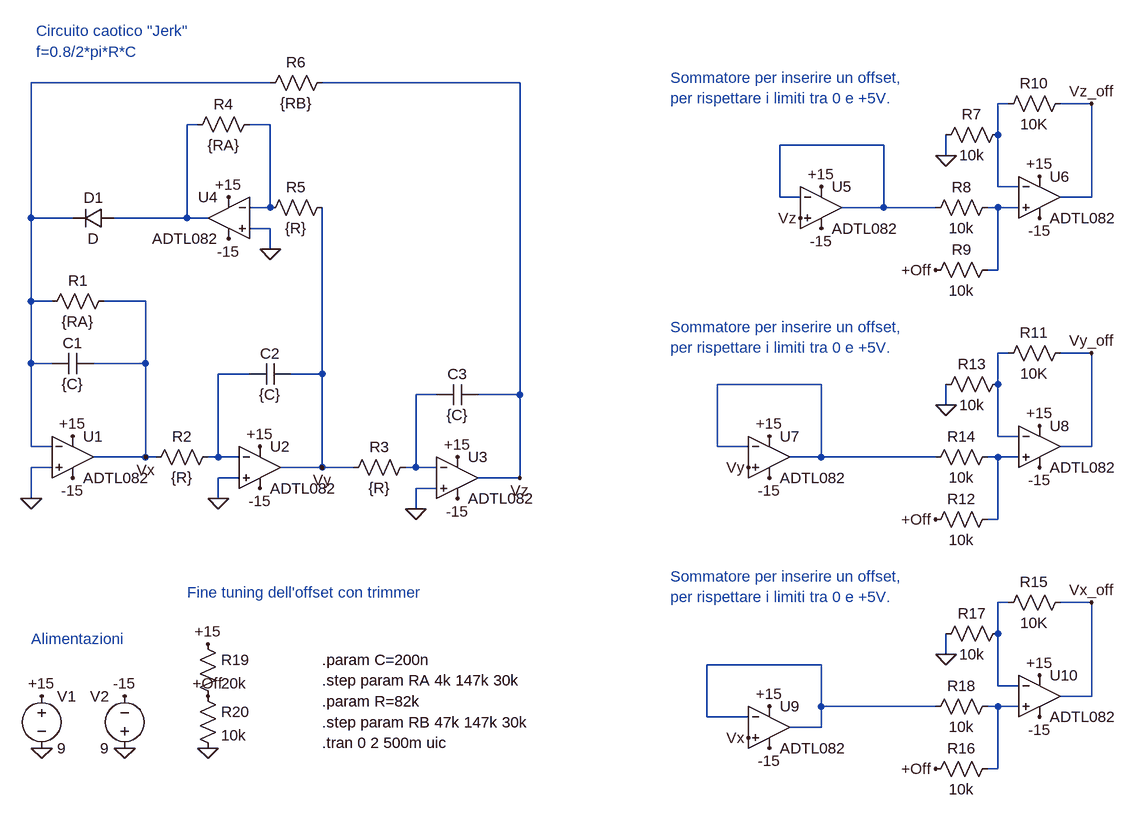
[diagram p0: schematic Spinta.asc]
Spinta.asc, the LTspice schematic file:
Version 4.1
SHEET 1 2248 976
WIRE 368 -336 0 -336
WIRE 752 -336 448 -336
WIRE 1504 -304 1488 -304
WIRE 1632 -304 1584 -304
WIRE 256 -272 240 -272
WIRE 368 -272 336 -272
WIRE 1488 -256 1488 -304
WIRE 1312 -240 1152 -240
WIRE 1408 -224 1408 -256
WIRE 1488 -176 1488 -256
WIRE 1520 -176 1488 -176
WIRE 1152 -160 1152 -240
WIRE 1184 -160 1152 -160
WIRE 1632 -160 1632 -304
WIRE 1632 -160 1584 -160
WIRE 368 -144 368 -272
WIRE 368 -144 336 -144
WIRE 1312 -144 1312 -240
WIRE 1312 -144 1248 -144
WIRE 1392 -144 1312 -144
WIRE 1488 -144 1472 -144
WIRE 1520 -144 1488 -144
WIRE 0 -128 0 -336
WIRE 64 -128 0 -128
WIRE 240 -128 240 -272
WIRE 240 -128 128 -128
WIRE 272 -128 240 -128
WIRE 368 -112 336 -112
WIRE 368 -80 368 -112
WIRE 1488 -48 1488 -144
WIRE 1488 -48 1472 -48
WIRE 0 0 0 -128
WIRE 32 0 0 0
WIRE 176 0 112 0
WIRE 1504 80 1488 80
WIRE 1632 80 1584 80
WIRE 0 96 0 0
WIRE 32 96 0 96
WIRE 176 96 176 0
WIRE 176 96 96 96
WIRE 336 112 288 112
WIRE 448 112 448 -144
WIRE 448 112 400 112
WIRE 1216 128 1056 128
WIRE 1488 128 1488 80
WIRE 624 144 592 144
WIRE 752 144 752 -336
WIRE 752 144 688 144
WIRE 1408 160 1408 128
WIRE 1488 208 1488 128
WIRE 1520 208 1488 208
WIRE 0 224 0 96
WIRE 32 224 0 224
WIRE 1056 224 1056 128
WIRE 1104 224 1056 224
WIRE 1632 224 1632 80
WIRE 1632 224 1584 224
WIRE 176 240 176 96
WIRE 176 240 96 240
WIRE 192 240 176 240
WIRE 288 240 288 112
WIRE 288 240 272 240
WIRE 320 240 288 240
WIRE 1216 240 1216 128
WIRE 1216 240 1168 240
WIRE 1392 240 1216 240
WIRE 1488 240 1472 240
WIRE 1520 240 1488 240
WIRE 32 256 0 256
WIRE 448 256 448 112
WIRE 448 256 384 256
WIRE 496 256 448 256
WIRE 592 256 592 144
WIRE 592 256 576 256
WIRE 624 256 592 256
WIRE 320 272 288 272
WIRE 752 272 752 144
WIRE 752 272 688 272
WIRE 624 288 592 288
WIRE 0 304 0 256
WIRE 288 304 288 272
WIRE 592 320 592 288
WIRE 1488 336 1488 240
WIRE 1488 336 1472 336
WIRE 1504 464 1488 464
WIRE 1632 464 1584 464
WIRE 1488 512 1488 464
WIRE 1408 544 1408 512
WIRE 1216 560 1040 560
WIRE 1488 592 1488 512
WIRE 1520 592 1488 592
WIRE 1632 608 1632 464
WIRE 1632 608 1584 608
WIRE 1216 624 1216 560
WIRE 1392 624 1216 624
WIRE 1488 624 1472 624
WIRE 1520 624 1488 624
WIRE 1040 640 1040 560
WIRE 1104 640 1040 640
WIRE 1216 656 1216 624
WIRE 1216 656 1168 656
WIRE 1488 720 1488 624
WIRE 1488 720 1472 720
FLAG 16 608 +15
FLAG 144 608 -15
FLAG 64 272 -15
FLAG 64 208 +15
FLAG 352 224 +15
FLAG 352 288 -15
FLAG 656 240 +15
FLAG 656 304 -15
FLAG 304 -160 +15
FLAG 304 -96 -15
FLAG 368 -80 0
FLAG 0 304 0
FLAG 288 304 0
FLAG 592 320 0
FLAG 176 240 Vx
FLAG 16 688 0
FLAG 144 688 0
FLAG 448 256 Vy
FLAG 752 272 Vz
FLAG 1552 -128 -15
FLAG 1552 -192 +15
FLAG 1392 -48 +Off
FLAG 1408 -224 0
FLAG 1632 -304 Vz_off
FLAG 1552 256 -15
FLAG 1552 192 +15
FLAG 1392 336 +Off
FLAG 1408 160 0
FLAG 1632 80 Vy_off
FLAG 1552 640 -15
FLAG 1552 576 +15
FLAG 1392 720 +Off
FLAG 1408 544 0
FLAG 1632 464 Vx_off
FLAG 272 688 0
FLAG 272 528 +15
FLAG 272 608 +Off
FLAG 1136 624 +15
FLAG 1136 688 -15
FLAG 1104 672 Vx
FLAG 1104 256 Vy
FLAG 1216 -176 +15
FLAG 1136 208 +15
FLAG 1216 -112 -15
FLAG 1136 272 -15
FLAG 1184 -128 Vz
SYMBOL OpAmps\\ADTL082 64 176 R0
SYMATTR InstName U1
SYMBOL cap 32 112 R270
WINDOW 0 32 32 VTop 2
WINDOW 3 0 32 VBottom 2
SYMATTR InstName C1
SYMATTR Value {C}
SYMBOL res 16 16 R270
WINDOW 0 32 56 VTop 2
WINDOW 3 0 56 VBottom 2
SYMATTR InstName R1
SYMATTR Value {RA}
SYMBOL OpAmps\\ADTL082 352 192 R0
SYMATTR InstName U2
SYMBOL res 176 256 R270
WINDOW 0 32 56 VTop 2
WINDOW 3 0 56 VBottom 2
SYMATTR InstName R2
SYMATTR Value {R}
SYMBOL res 480 272 R270
WINDOW 0 32 56 VTop 2
WINDOW 3 0 56 VBottom 2
SYMATTR InstName R3
SYMATTR Value {R}
SYMBOL OpAmps\\ADTL082 656 208 R0
SYMATTR InstName U3
SYMBOL cap 336 128 R270
WINDOW 0 32 32 VTop 2
WINDOW 3 0 32 VBottom 2
SYMATTR InstName C2
SYMATTR Value {C}
SYMBOL cap 688 128 R90
WINDOW 0 0 32 VBottom 2
WINDOW 3 32 32 VTop 2
SYMATTR InstName C3
SYMATTR Value {C}
SYMBOL OpAmps\\ADTL082 304 -192 M0
SYMATTR InstName U4
SYMBOL res 352 -128 R270
WINDOW 0 32 56 VTop 2
WINDOW 3 0 56 VBottom 2
SYMATTR InstName R5
SYMATTR Value {R}
SYMBOL res 352 -320 R270
WINDOW 0 32 56 VTop 2
WINDOW 3 0 56 VBottom 2
SYMATTR InstName R6
SYMATTR Value {RB}
SYMBOL voltage 16 592 R0
WINDOW 123 0 0 Left 0
WINDOW 39 0 0 Left 0
SYMATTR InstName V1
SYMATTR Value 9
SYMBOL voltage 144 704 R180
WINDOW 0 24 96 Left 2
WINDOW 3 24 16 Left 2
WINDOW 123 0 0 Left 0
WINDOW 39 0 0 Left 0
SYMATTR InstName V2
SYMATTR Value 9
SYMBOL diode 128 -144 R90
WINDOW 0 0 32 VBottom 2
WINDOW 3 32 32 VTop 2
SYMATTR InstName D1
SYMBOL res 240 -256 R270
WINDOW 0 32 56 VTop 2
WINDOW 3 0 56 VBottom 2
SYMATTR InstName R4
SYMATTR Value {RA}
SYMBOL OpAmps\\ADTL082 1552 -224 R0
SYMATTR InstName U6
SYMBOL res 1488 -288 R270
WINDOW 0 32 56 VTop 2
WINDOW 3 0 56 VBottom 2
SYMATTR InstName R10
SYMATTR Value 10K
SYMATTR SpiceLine tol=1 pwr=0.1
SYMBOL res 1376 -32 R270
WINDOW 0 32 56 VTop 2
WINDOW 3 0 56 VBottom 2
SYMATTR InstName R9
SYMATTR Value 10k
SYMATTR SpiceLine tol=1 pwr=0.1
SYMBOL res 1504 -272 R90
WINDOW 0 0 56 VBottom 2
WINDOW 3 32 56 VTop 2
SYMATTR InstName R7
SYMATTR Value 10k
SYMATTR SpiceLine tol=1 pwr=0.1
SYMBOL res 1488 -160 R90
WINDOW 0 0 56 VBottom 2
WINDOW 3 32 56 VTop 2
SYMATTR InstName R8
SYMATTR Value 10k
SYMBOL OpAmps\\ADTL082 1552 160 R0
SYMATTR InstName U8
SYMBOL res 1488 96 R270
WINDOW 0 32 56 VTop 2
WINDOW 3 0 56 VBottom 2
SYMATTR InstName R11
SYMATTR Value 10K
SYMATTR SpiceLine tol=1 pwr=0.1
SYMBOL res 1376 352 R270
WINDOW 0 32 56 VTop 2
WINDOW 3 0 56 VBottom 2
SYMATTR InstName R12
SYMATTR Value 10k
SYMATTR SpiceLine tol=1 pwr=0.1
SYMBOL res 1504 112 R90
WINDOW 0 0 56 VBottom 2
WINDOW 3 32 56 VTop 2
SYMATTR InstName R13
SYMATTR Value 10k
SYMATTR SpiceLine tol=1 pwr=0.1
SYMBOL res 1488 224 R90
WINDOW 0 0 56 VBottom 2
WINDOW 3 32 56 VTop 2
SYMATTR InstName R14
SYMATTR Value 10k
SYMBOL OpAmps\\ADTL082 1552 544 R0
SYMATTR InstName U10
SYMBOL res 1488 480 R270
WINDOW 0 32 56 VTop 2
WINDOW 3 0 56 VBottom 2
SYMATTR InstName R15
SYMATTR Value 10K
SYMATTR SpiceLine tol=1 pwr=0.1
SYMBOL res 1376 736 R270
WINDOW 0 32 56 VTop 2
WINDOW 3 0 56 VBottom 2
SYMATTR InstName R16
SYMATTR Value 10k
SYMATTR SpiceLine tol=1 pwr=0.1
SYMBOL res 1504 496 R90
WINDOW 0 0 56 VBottom 2
WINDOW 3 32 56 VTop 2
SYMATTR InstName R17
SYMATTR Value 10k
SYMATTR SpiceLine tol=1 pwr=0.1
SYMBOL res 1488 608 R90
WINDOW 0 0 56 VBottom 2
WINDOW 3 32 56 VTop 2
SYMATTR InstName R18
SYMATTR Value 10k
SYMBOL res 256 512 R0
SYMATTR InstName R19
SYMATTR Value 20k
SYMBOL res 256 592 R0
SYMATTR InstName R20
SYMATTR Value 10k
SYMBOL OpAmps\\ADTL082 1216 -208 R0
SYMATTR InstName U5
SYMBOL OpAmps\\ADTL082 1136 176 R0
SYMATTR InstName U7
SYMBOL OpAmps\\ADTL082 1136 592 R0
SYMATTR InstName U9
TEXT 448 680 Left 2 !.tran 0 2 500m uic
TEXT 8 -416 Left 2 ;Circuito caotico "Jerk"
TEXT 448 584 Left 2 !.step param RA 4k 147k 30k
TEXT 448 552 Left 2 !.param C=200n
TEXT 8 -384 Left 2 ;f=0.8/2*pi*R*C
TEXT 984 -344 Left 2 ;Sommatore per inserire un offset,\nper rispettare i limiti tra 0 e +5V.
TEXT 984 40 Left 2 ;Sommatore per inserire un offset,\nper rispettare i limiti tra 0 e +5V.
TEXT 984 424 Left 2 ;Sommatore per inserire un offset,\nper rispettare i limiti tra 0 e +5V.
TEXT 0 520 Left 2 ;Alimentazioni
TEXT 240 448 Left 2 ;Fine tuning dell'offset con trimmer
TEXT 448 616 Left 2 !.param R=82k
TEXT 448 648 Left 2 !.step param RB 47k 147k 30k

The netlist it stands for:
* Spinta.asc
X§U1 0 N001 +15 -15 Vx ADTL082  ; pins In+ In- V+ V- OUT
C1 N001 Vx {C}
R1 N001 Vx {RA}
X§U2 0 N008 +15 -15 Vy ADTL082  ; pins In+ In- V+ V- OUT
R2 Vx N008 {R}
R3 Vy N010 {R}
X§U3 0 N010 +15 -15 Vz ADTL082  ; pins In+ In- V+ V- OUT
C2 N008 Vy {C}
C3 Vz N010 {C}
X§U4 0 N004 +15 -15 N003 ADTL082  ; pins In+ In- V+ V- OUT
R5 N004 Vy {R}
R6 N001 Vz {RB}
V1 +15 0 9
V2 0 -15 9
D1 N003 N001 D
R4 N003 N004 {RA}
X§U6 N006 N002 +15 -15 Vz_off ADTL082  ; pins In+ In- V+ V- OUT
R10 N002 Vz_off 10K tol=1 pwr=0.1
R9 +Off N006 10k tol=1 pwr=0.1
R7 N002 0 10k tol=1 pwr=0.1
R8 N006 N005 10k
X§U8 N011 N007 +15 -15 Vy_off ADTL082  ; pins In+ In- V+ V- OUT
R11 N007 Vy_off 10K tol=1 pwr=0.1
R12 +Off N011 10k tol=1 pwr=0.1
R13 N007 0 10k tol=1 pwr=0.1
R14 N011 N009 10k
X§U10 N014 N012 +15 -15 Vx_off ADTL082  ; pins In+ In- V+ V- OUT
R15 N012 Vx_off 10K tol=1 pwr=0.1
R16 +Off N014 10k tol=1 pwr=0.1
R17 N012 0 10k tol=1 pwr=0.1
R18 N014 N013 10k
R19 +15 +Off 20k
R20 +Off 0 10k
X§U5 Vz N005 +15 -15 N005 ADTL082  ; pins In+ In- V+ V- OUT
X§U7 Vy N009 +15 -15 N009 ADTL082  ; pins In+ In- V+ V- OUT
X§U9 Vx N013 +15 -15 N013 ADTL082  ; pins In+ In- V+ V- OUT
.model D D
.lib standard.dio
.tran 0 2 500m uic
* Circuito caotico "Jerk"
.step param RA 4k 147k 30k
.param C=200n
* f=0.8/2*pi*R*C
* Sommatore per inserire un offset,
* per rispettare i limiti tra 0 e +5V.
* Sommatore per inserire un offset,
* per rispettare i limiti tra 0 e +5V.
* Sommatore per inserire un offset,
* per rispettare i limiti tra 0 e +5V.
* Alimentazioni
* Fine tuning dell'offset con trimmer
.param R=82k
.step param RB 47k 147k 30k
.lib ADI.lib
.backanno
.end